# Altium schematic sheet blockdiagram.SchDoc
size A3
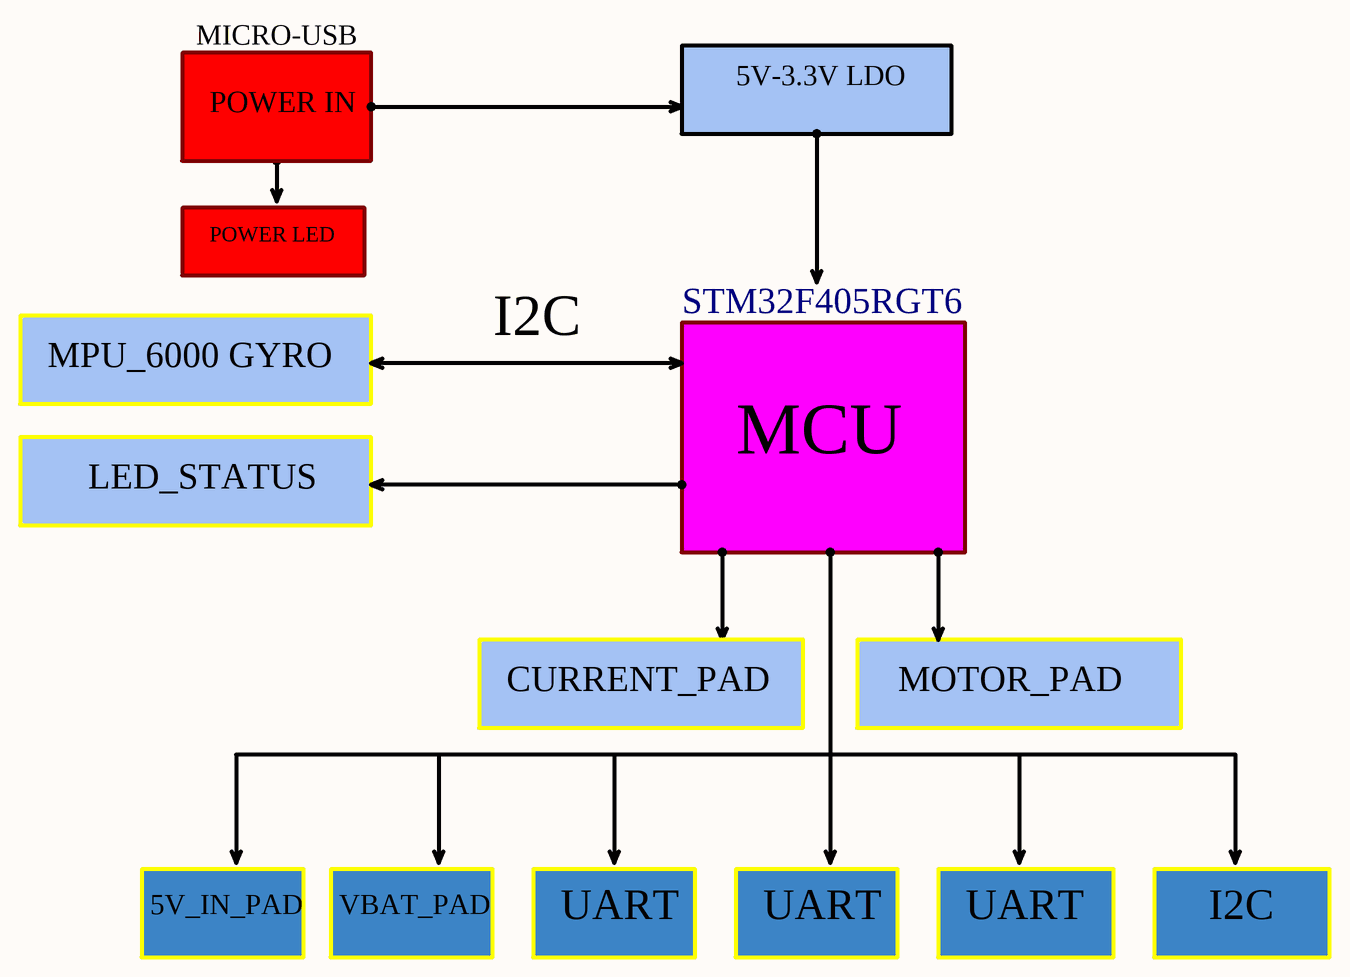
[diagram p0: blockdiagram.SchDoc]

## Notes on the sheet
- MICRO-USB
- POWER IN
- 5V-3.3V LDO
- POWER LED
- STM32F405RGT6
- MPU_6000 GYRO
- I2C
- MCU
- LED_STATUS
- CURRENT_PAD
- MOTOR_PAD
- 5V_IN_PAD
- VBAT_PAD
- UART